# Altium project Course work.PrjPcb (part 1 of 3)
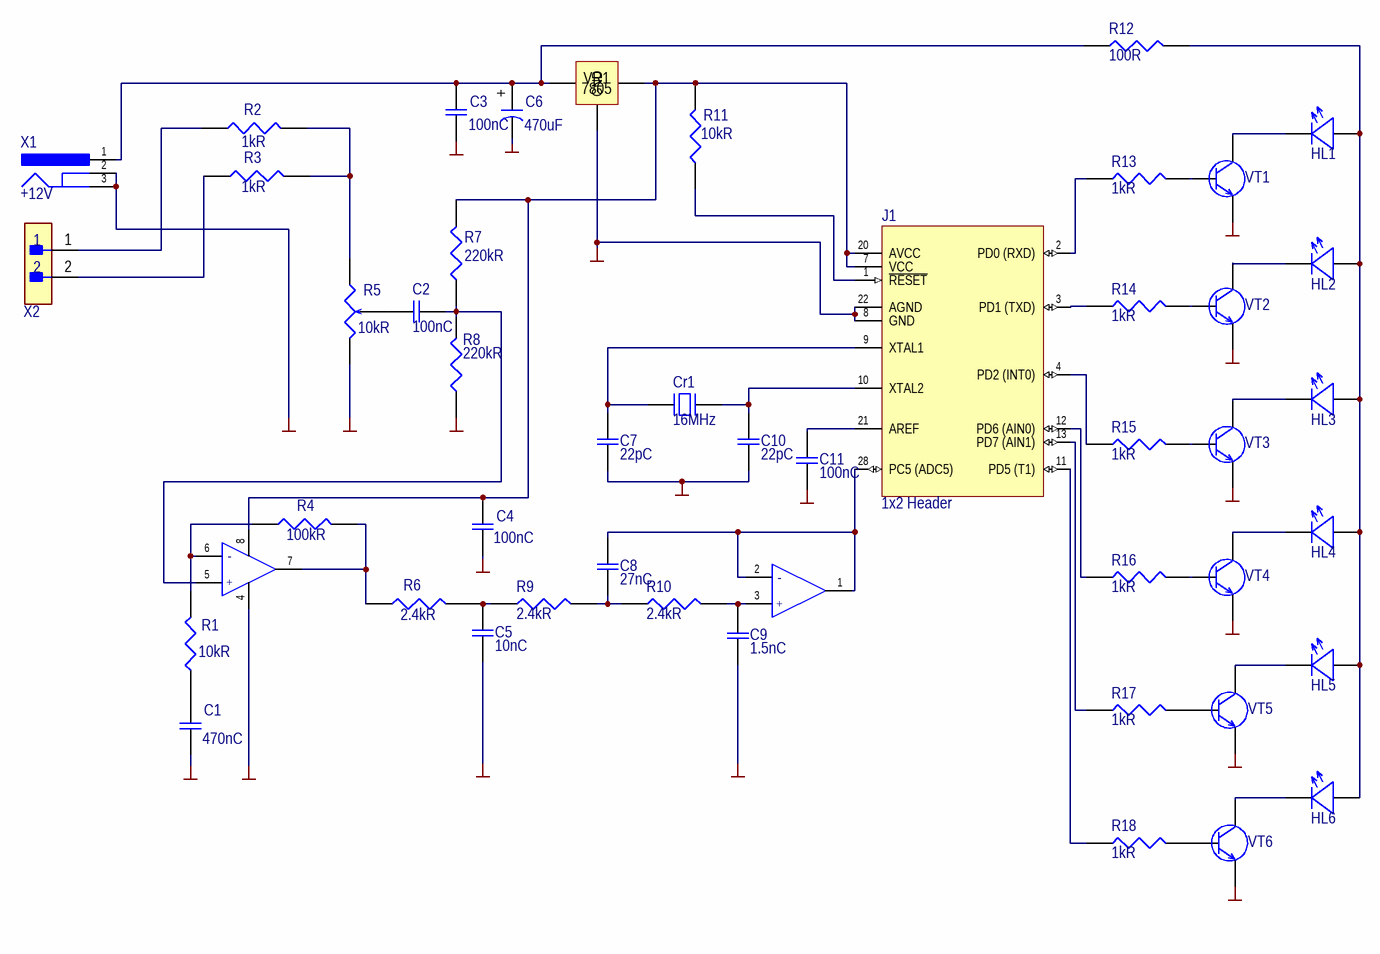
[diagram p0: CW.SchDoc]
Наименование: Курсова робота; Папка для сохранения графической документации: Документация; Папка для сохранения текстовой документации: Документация; Проверил: Короткий Є.В; Разработал: Тимченко К.О.
1 sheet, 47 parts. Net scope: global (net labels, ports and power ports of the same name join across sheets).
Board file: CW.PcbDoc

## Sheet CW.SchDoc
size 420 x 297 mm; Date: 26.01.2021; Author: Kateryna Tymchenko; SheetNumber: 1; SheetTotal: 1

### Parts
C1  470nC  [C470nF]
C2  100nC  [C100nF]
C3  100nC  [C100nF]
C4  100nC  [C100nF]
C5  10nC  [C10nF]
C6  470uF  [ElectrolyticCap]
C7  22pC  [C22pF]
C8  27nC  [C27nF]
C9  1.5nC  [C1.5nF]
C10  22pC  [C22pF]
C11  100nC  [C100nF]
Cr1  16MHz  [Crystal]
DA1  Amplifier (part B)  [LM358]  (value not drawn)  (parts A,B of 2)
DA2  5V  [LM7805]  (value not drawn)
HL1  red led  [LEDred]  (value not drawn)
HL2  blue led  [LEDblue]  (value not drawn)
HL3  red led  [LEDred]  (value not drawn)
HL4  green led  [LEDgreen]  (value not drawn)
HL5  yellow led  [LEDyellow]  (value not drawn)
HL6  green led  [LEDgreen]  (value not drawn)
J1  1x2 Header  [ATmega8]
R1  10kR  [R10kOhm]
R2  1kR  [R1kOhm]
R3  1kR  [R1kOhm]
R4  100kR  [R100kOhm]
R5  10kR  [Potentiometer]
R6  2.4kR  [R2.4kohm]
R7  220kR  [R220kOhm]
R8  220kR  [R220kOhm]
R9  2.4kR  [R2.4kohm]
R10  2.4kR  [R2.4kohm]
R11  10kR  [R10kOhm]
R12  100R  [R100Ohm]
R13  1kR  [R1kOhm]
R14  1kR  [R1kOhm]
R15  1kR  [R1kOhm]
R16  1kR  [R1kOhm]
R17  1kR  [R1kOhm]
R18  1kR  [R1kOhm]
VT1  BC639  [BC639]  (value not drawn)
VT2  BC639  [BC639]  (value not drawn)
VT3  BC639  [BC639]  (value not drawn)
VT4  BC639  [BC639]  (value not drawn)
VT5  BC639  [BC639]  (value not drawn)
VT6  BC639  [BC639]  (value not drawn)
X1  +12V  [PG_Connector]
X2  ConnectorAudio  [AudioConnector]  (value not drawn)

### Nets
GND: C1.1 C3.1 C4.1 C5.1 C6.- C7.1 C9.1 C10.1 C11.1 DA1.4(GND) DA2.3(GND) J1.8(GND) J1.22(AGND) R5.2 R8.1 VT1.3(GND) VT2.3(GND) VT3.3(GND) VT4.3(GND) VT5.3(GND) VT6.3(GND) X1.2 X1.3(GND)
NetC1_2: C1.2 R1.1
NetC2_1: C2.1 R5.3
NetC2_2: C2.2 DA1.5(+) R7.1 R8.2
NetC3_2: C3.2 C6.+ DA2.1(Input) R12.1 X1.1(PWR)
NetC4_2: C4.2 DA1.8(VCC) DA2.2(Output) J1.7(VCC) J1.20(AVCC) R7.2 R11.2
NetC5_2: C5.2 R9.1
NetC7_2: C7.2 Cr1.1 J1.9(XTAL1)
NetC8_1: C8.1 R9.2 R10.1
NetC8_2: C8.2 DA1.1(OUT_A) DA1.2(-) J1.28(PC5_(ADC5))
NetC9_2: C9.2 DA1.3(+) R10.2
NetC10_2: C10.2 Cr1.2 J1.10(XTAL2)
NetC11_2: C11.2 J1.21(AREF)
NetDA1_6: DA1.6(-) R1.2 R4.1
NetDA1_7: DA1.7(OUT_B) R4.2 R6.1
NetHL1_1: HL1.1(-) VT1.2
NetHL1_2: HL1.2(+) HL2.2(+) HL3.2(+) HL4.2(+) HL5.2(+) HL6.2(+) R12.2
NetHL2_1: HL2.1(-) VT2.2
NetHL3_1: HL3.1(-) VT3.2
NetHL4_1: HL4.1(-) VT4.2
NetHL5_1: HL5.1(-) VT5.2
NetHL6_1: HL6.1(-) VT6.2
NetJ1_1: J1.1(~{RESET}) R11.1
NetJ1_2: J1.2(PD0_(RXD)) R13.1
NetJ1_3: J1.3(PD1_(TXD)) R14.1
NetJ1_4: J1.4(PD2_(INT0)) R15.1
NetJ1_11: J1.11(PD5_(T1)) R18.1
NetJ1_12: J1.12(PD6_(AIN0)) R16.1
NetJ1_13: J1.13(PD7_(AIN1)) R17.1
NetR2_1: R2.1 X2.1
NetR2_2: R2.2 R3.2 R5.1
NetR3_1: R3.1 X2.2
NetR13_2: R13.2 VT1.1
NetR14_2: R14.2 VT2.1
NetR15_2: R15.2 VT3.1
NetR16_2: R16.2 VT4.1
NetR17_2: R17.2 VT5.1
NetR18_2: R18.2 VT6.1

Not connected (* = marked no-connect by the designer): R6 2

### Notes on the sheet
- Перв. примен.
- Справ. №
- Подп. и дата
- Инв. № дубл.
- Взам. инв. №
- Разраб.
- Изм.
- Лист
- № докум.
- Подп.
- Дата
- Лит.
- Масса
- Масштаб
- Пров.
- Т. контр.
- Листов
- Инв. № подл.
- Н. контр.
- Утв.
- Копировал
- Формат А3
- (in symbol LM7805CT/NOPB) VR1; 7805